# EAGLE schematic iiitduino_copy (EAGLE 7.5.0)
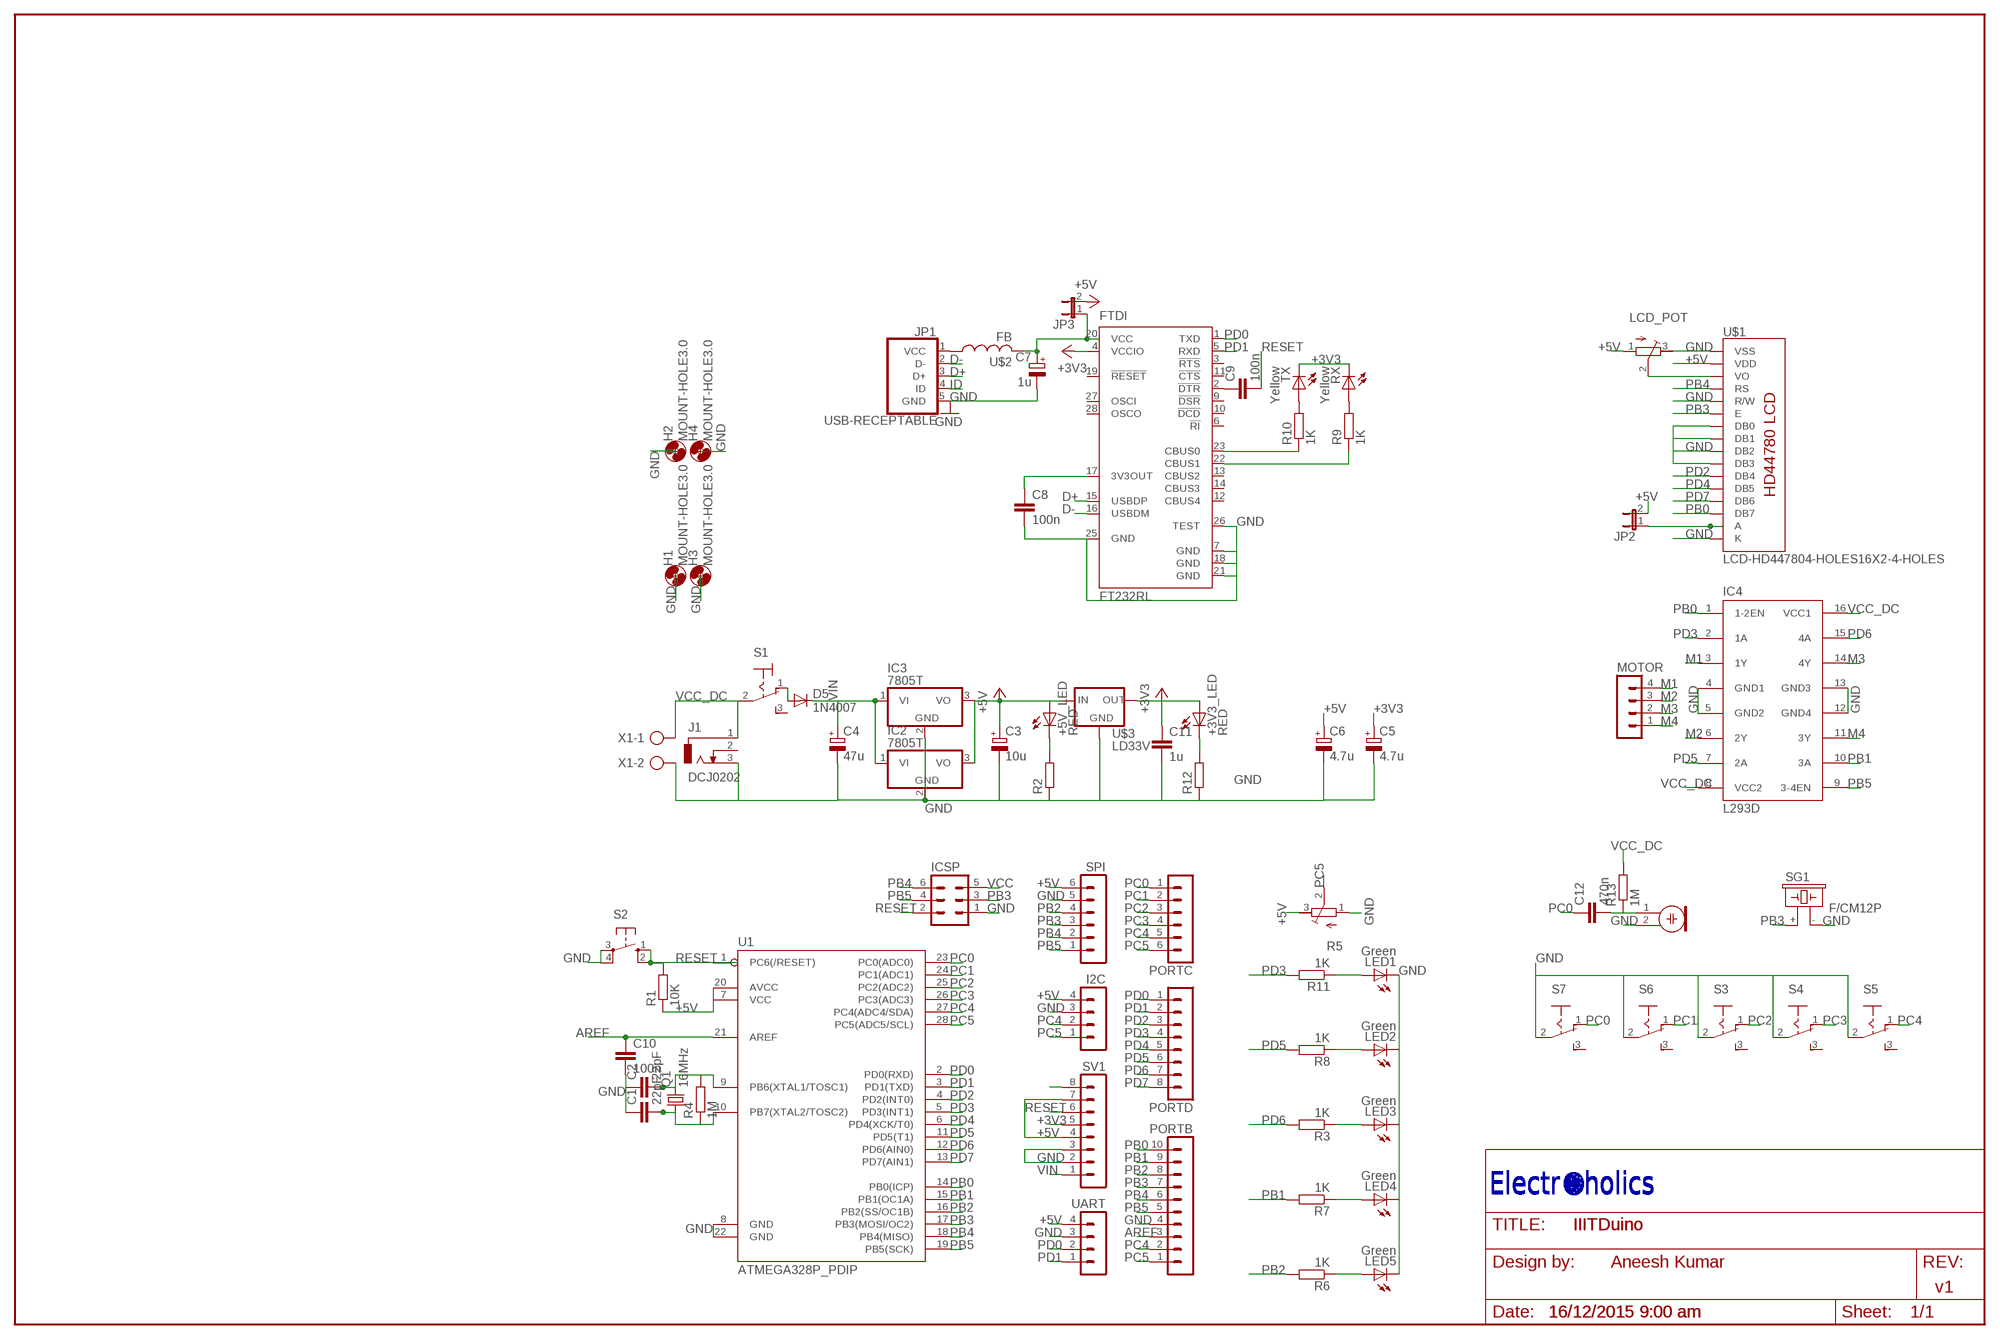
[diagram p0: schematic, sheet 1]
FRAME1 (TABL_L): DRAWING_NAME: IIITDuino; LAST_DATE_TIME: 16/12/2015 9:00 am

## Parts
+3V3_LED  RED  LED3MM  [LED3MM]
+5V_LED  RED  LED3MM  [LED3MM]
C1  22pF  C-EU025-025X050  [C025-025X050]
C2  22pF  C-EU025-025X050  [C025-025X050]
C3  10u  CPOL-EUE2.5-6  [E2,5-6]
C4  47u  CPOL-EUE5-10.5  [E5-10,5]
C5  4.7u  CPOL-EUE2.5-6  [E2,5-6]
C6  4.7u  CPOL-EUE2.5-6  [E2,5-6]
C7  1u  CPOL-EUE2.5-6  [E2,5-6]
C8  100n  C-EU025-025X050  [C025-025X050]
C9  100n  C-EU025-025X050  [C025-025X050]
C10  100n  C-EU025-025X050  [C025-025X050]
C11  1u  C-EU025-025X050  [C025-025X050]
C12  470n  C-EU025-025X050  [C025-025X050]
D5  1N4007  1N4004  [DO41-10]
FTDI  FT232RL  [SSOP28]
H1  MOUNT-HOLE3.0  [3,0]
H2  MOUNT-HOLE3.0  [3,0]
H3  MOUNT-HOLE3.0  [3,0]
H4  MOUNT-HOLE3.0  [3,0]
I2C  MA04-1  [MA04-1]
IC2  7805T  [TO220H]
IC3  7805T  [TO220H]
IC4  L293D  [DIL16]
ICSP  MA03-2  [MA03-2]
J1  DCJ0202  [DCJ0202]
JP1  USB-RECEPTABLE  [FCI-10103594-0001LF]
JP2  JP1E  [JP1]
JP3  JP1E  [JP1]
LCD_POT  R-TRIMM64W  [RTRIM64W]
LED1  Green  LED3MM  [LED3MM]
LED2  Green  LED3MM  [LED3MM]
LED3  Green  LED3MM  [LED3MM]
LED4  Green  LED3MM  [LED3MM]
LED5  Green  LED3MM  [LED3MM]
M1  ELECTRET_MICROPHON-F6050AP  [F6050AP]
MOTOR  MA04-1  [MA04-1]
PORTB  MA10-1W  [MA10-1W]
PORTC  MA06-1  [MA06-1]
PORTD  MA08-1  [MA08-1]
Q1  16MHz  CRYSTALHC49U70  [HC49U70]
R1  10K  R-EU_0207/10  [0207/10]
R2  R-EU_0207/7  [0207/7]
R3  1K  R-EU_0207/10  [0207/10]
R4  1M  R-EU_0207/10  [0207/10]
R5  R-TRIMM64W  [RTRIM64W]
R6  1K  R-EU_0207/10  [0207/10]
R7  1K  R-EU_0207/10  [0207/10]
R8  1K  R-EU_0207/10  [0207/10]
R9  1K  R-EU_0207/7  [0207/7]
R10  1K  R-EU_0207/7  [0207/7]
R11  1K  R-EU_0207/10  [0207/10]
R12  R-EU_0207/7  [0207/7]
R13  1M  R-EU_0207/10  [0207/10]
RX  Yellow  LED3MM  [LED3MM]
S1  320-916  [320-916]
S2  10-XX  [B3F-10XX]
S3  255SB  [255SB]
S4  255SB  [255SB]
S5  255SB  [255SB]
S6  255SB  [255SB]
S7  255SB  [255SB]
SG1  F/CM12P  [F/CM12P]
SPI  MA06-1  [MA06-1]
SV1  MA08-1  [MA08-1]
TX  Yellow  LED3MM  [LED3MM]
U1  ATMEGA328P_PDIP  [DIL28-3]
U$1  LCD-HD447804-HOLES16X2-4-HOLES  [LCD-16X2-4HOLES]
U$2  FB  [FB]
U$3  LD33V  [TO-220]
UART  MA04-1  [MA04-1]
X1  AK300/2  [AK300/2]

## Nets
+3V3: +3V3_LED.A C5.+ C11.1 FTDI.4(VCCIO) RX.K(C) SV1.5 TX.K(C) U$3.2(OUT)
+5V: +5V_LED.A C3.+ C6.+ C7.+ FTDI.20(VCC) I2C.4 IC2.3(VO) IC3.3(VO) JP2.2 JP3.1 JP3.2 LCD_POT.1(A) R1.1 R5.3(E) SPI.6 SV1.4 SV1.7 U1.7(VCC) U1.20(AVCC) U$1.2(VDD) U$2.P$2 U$3.3(IN) UART.4
AREF: C10.1 PORTB.3 U1.21(AREF)
D+: FTDI.15(USBDP) JP1.3(D+)
D-: FTDI.16(USBDM) JP1.2(D-)
GND: C1.1 C2.1 C3.- C4.- C5.- C6.- C7.- C8.2 C10.2 C11.2 FTDI.7(GND) FTDI.18(GND) FTDI.21(GND) FTDI.25(GND) FTDI.26(TEST) I2C.3 IC2.2(GND) IC3.2(GND) IC4.4(GND1) IC4.5(GND2) IC4.12(GND4) IC4.13(GND3) ICSP.1 J1.3 JP1.5(GND) LCD_POT.3(E) LED1.K(C) LED2.K(C) LED3.K(C) LED4.K(C) LED5.K(C) M1.2 PORTB.4 R2.1 R5.1(A) R12.1 S2.3(P) S2.4(P1) S3.2(P) S4.2(P) S5.2(P) S6.2(P) S7.2(P) SG1.- SPI.5 SV1.2 SV1.3 U1.8(GND) U1.22(GND) U$1.1(VSS) U$1.5(R/W) U$1.7(DB0) U$1.8(DB1) U$1.9(DB2) U$1.10(DB3) U$1.16(K) U$3.1(GND) UART.3 X1.2
ID: JP1.4(ID)
M1: IC4.3(1Y) MOTOR.4
M2: IC4.6(2Y) MOTOR.3
M3: IC4.14(4Y) MOTOR.2
M4: IC4.11(3Y) MOTOR.1
N$1: JP1.1(VCC) U$2.P$1
N$2: C1.2 Q1.1 R4.1 U1.10(PB7(XTAL2/TOSC2))
N$3: D5.A S1.1(O)
N$4: +3V3_LED.K(C) R12.2
N$5: C12.2 M1.1 R13.1
N$7: C8.1 FTDI.17(3V3OUT)
N$8: +5V_LED.K(C) R2.2
N$9: JP2.1 U$1.15(A)
N$10: LED3.A R3.1
N$11: R10.2 TX.A
N$12: C2.2 Q1.2 R4.2 U1.9(PB6(XTAL1/TOSC1))
N$13: R9.2 RX.A
N$14: FTDI.23(CBUS0) R10.1
N$15: FTDI.22(CBUS1) R9.1
N$16: C9.1 FTDI.2(!DTR)
N$18: LED5.A R6.1
N$20: LED4.A R7.1
N$22: LED2.A R8.1
N$24: LED1.A R11.1
N$25: SV1.8
PB0: IC4.1(1-2EN) PORTB.10 U1.14(PB0(ICP)) U$1.14(DB7)
PB1: IC4.10(3A) PORTB.9 R7.2 U1.15(PB1(OC1A))
PB2: PORTB.8 R6.2 SPI.4 U1.16(PB2(SS/OC1B))
PB3: ICSP.3 PORTB.7 SG1.+ SPI.3 U1.17(PB3(MOSI/OC2)) U$1.6(E)
PB4: ICSP.6 PORTB.6 SPI.2 U1.18(PB4(MISO)) U$1.4(RS)
PB5: IC4.9(3-4EN) ICSP.4 PORTB.5 SPI.1 U1.19(PB5(SCK))
PC0: C12.1 PORTC.1 S7.1(O) U1.23(PC0(ADC0))
PC1: PORTC.2 S6.1(O) U1.24(PC1(ADC1))
PC2: PORTC.3 S3.1(O) U1.25(PC2(ADC2))
PC3: PORTC.4 S4.1(O) U1.26(PC3(ADC3))
PC4: I2C.2 PORTB.2 PORTC.5 S5.1(O) U1.27(PC4(ADC4/SDA))
PC5: I2C.1 PORTB.1 PORTC.6 R5.2(S) U1.28(PC5(ADC5/SCL))
PC6: U1.1(PC6(/RESET))
PD0: FTDI.1(TXD) PORTD.1 U1.2(PD0(RXD)) UART.2
PD1: FTDI.5(RXD) PORTD.2 U1.3(PD1(TXD)) UART.1
PD2: PORTD.3 U1.4(PD2(INT0)) U$1.11(DB4)
PD3: IC4.2(1A) PORTD.4 R11.2 U1.5(PD3(INT1))
PD4: PORTD.5 U1.6(PD4(XCK/T0)) U$1.12(DB5)
PD5: IC4.7(2A) PORTD.6 R8.2 U1.11(PD5(T1))
PD6: IC4.15(4A) PORTD.7 R3.2 U1.12(PD6(AIN0))
PD7: PORTD.8 U1.13(PD7(AIN1)) U$1.13(DB6)
RESET: C9.2 ICSP.2 R1.2 S2.1(S) S2.2(S1) SV1.6
VCC: ICSP.5
VCC_DC: IC4.8(VCC2) IC4.16(VCC1) J1.1 R13.2 S1.2(P) X1.1
VIN: C4.+ D5.C IC2.1(VI) IC3.1(VI) SV1.1
VO: LCD_POT.2(S) U$1.3(VO)
Unconnected: FTDI.3(!RTS) FTDI.6(!RI) FTDI.9(!DSR) FTDI.10(!DCD) FTDI.11(!CTS) FTDI.12(CBUS4) FTDI.13(CBUS2) FTDI.14(CBUS3) FTDI.19(!RESET) FTDI.27(OSCI) FTDI.28(OSCO) J1.2 S1.3(S) S3.3(S) S4.3(S) S5.3(S) S6.3(S) S7.3(S)

## Library data of the parts
+3V3_LED +5V_LED LED1-LED5 RX TX = led:LED: LED OSRAM: - CHIPLED LG R971, LG N971, LY N971, LG Q971, LY Q971, LO R971, LY R971 LH N974, LH R974 LS Q976, LO Q976, LY Q976 LO Q996 - Hyper CHIPLED LW Q18S LB Q993, LB Q99A, LB R99A - SideLED LS A670, LO A670, LY A670, LG A670, LP A670 LB A673, LV A673, LT A673, LW A673 LH A674 LY A675 LS A676, LA A676, LO A676, LY A676, LW A676 LS A679, LY A679, LG A679 - Hyper Micro SIDELED® LS Y876, LA Y876, LO Y876, LY Y876 LT Y87S - SmartLED LW L88C, LW L88S LB L89C, LB L89S, LG L890 LS L89K, LO L89K, LY L89K LS L896, LA L896, LO L896, LY L896 - TOPLED LS T670, LO T670, LY T670, LG T670, LP T670 LSG T670, LSP T670, LSY T670, LOP T670, LYG T670 LG T671, LOG T671, LSG T671 LB T673, LV T673, LT T673, LW T673 LH T674 LS T676, LA T676, LO T676, LY T676, LB T676, LH T676, LSB T676, LW T676 LB T67C, LV T67C, LT T67C, LS T67K, LO T67K, LY T67K, LW E67C LS E67B, LA E67B, LO E67B, LY E67B, LB E67C, LV E67C, LT E67C LW T67C LS T679, LY T679, LG T679 LS T770, LO T770, LY T770, LG T770, LP T770 LB T773, LV T773, LT T773, LW T773 LH T774 LS E675, LA E675, LY E675, LS T675 LS T776, LA T776, LO T776, LY T776, LB T776 LHGB T686 LT T68C, LB T68C - Hyper Mini TOPLED® LB M676 - Mini TOPLED Santana® LG M470 LS M47K, LO M47K, LY M47K Source: http://www.osram.convergy.de LUXEON: - LUMILED® LXK2-PW12-R00, LXK2-PW12-S00, LXK2-PW14-U00, LXK2-PW14-V00 LXK2-PM12-R00, LXK2-PM12-S00, LXK2-PM14-U00 LXK2-PE12-Q00, LXK2-PE12-R00, LXK2-PE12-S00, LXK2-PE14-T00, LXK2-PE14-U00 LXK2-PB12-K00, LXK2-PB12-L00, LXK2-PB12-M00, LXK2-PB14-N00, LXK2-PB14-P00, LXK2-PB14-Q00 LXK2-PR12-L00, LXK2-PR12-M00, LXK2-PR14-Q00, LXK2-PR14-R00 LXK2-PD12-Q00, LXK2-PD12-R00, LXK2-PD12-S00 LXK2-PH12-R00, LXK2-PH12-S00 LXK2-PL12-P00, LXK2-PL12-Q00, LXK2-PL12-R00 Source: www.luxeon.com KINGBRIGHT: KA-3528ASYC Source: www.kingbright.com
C1 C2 C8-C12 = rcl:C-EU: CAPACITOR, European symbol
C3-C7 = rcl:CPOL-EU: POLARIZED CAPACITOR, European symbol
D5 = diode:1N4004: DIODE general purpose rectifier, 1 A
FTDI = ftdichip:FT232R: Source: http://www.ftdichip.com/Documents/DataSheets/DS_FT232R_v104.pdf; MPN: FT232RL; OC_FARNELL: 1146032; OC_NEWARK: 91K9918
H1-H4 = holes:MOUNT-HOLE: MOUNTING HOLE with drill center marker
I2C MOTOR UART = con-lstb:MA04-1: PIN HEADER; OC_FARNELL: unknown; OC_NEWARK: unknown
IC2 IC3 = linear:78*: Positive VOLTAGE REGULATOR Source: http://cache.national.com/ds/LM/LM78L05.pdf http://www.fairchildsemi.com/ds/LM/LM7805.pdf
IC4 = st-microelectronics:L293D: PUSH-PULL 4 CHANNEL DRIVER; MPN: L293D; OC_FARNELL: 9589619; OC_NEWARK: 56P8249
ICSP = con-lstb:MA03-2: PIN HEADER; OC_FARNELL: unknown; OC_NEWARK: unknown
J1 = con-jack:DCJ0202: DC POWER JACK Source: DCJ0202.pdf; OC_FARNELL: unknown; OC_NEWARK: unknown
JP1 = daspilker:USB-RECEPTABLE: USB Receptable
JP2 JP3 = jumper:JP1E: JUMPER
LCD_POT R5 = rcl:R-TRIMM: Trimm resistor
M1 = microphon:ELECTRET_MICROPHON-: Electret Condenser Microphone
PORTB = con-lstb:MA10-1W: PIN HEADER; OC_FARNELL: unknown; OC_NEWARK: unknown
PORTC SPI = con-lstb:MA06-1: PIN HEADER; OC_FARNELL: unknown; OC_NEWARK: unknown
PORTD SV1 = con-lstb:MA08-1: PIN HEADER; OC_FARNELL: unknown; OC_NEWARK: unknown
Q1 = crystal:CRYSTAL: CRYSTAL; OC_FARNELL: unknown; OC_NEWARK: unknown
R1-R4 R6-R13 = rcl:R-EU_: RESISTOR, European symbol
S1 = switch:320-916: TOGGLE SWITCH distributor RS Components
S2 = switch-omron:10-XX: OMRON SWITCH; MPN: B3F-1000; OC_FARNELL: 176432; OC_NEWARK: 36M3542
S3-S7 = switch:255SB: SLIDING SWITCH Distributor Buerklin, 11G810
SG1 = buzzer:F/CM12P: BUZZER Source: Buerklin; OC_FARNELL: unknown; OC_NEWARK: unknown
U1 = SparkFun-DigitalIC:ATMEGA328P_PDIP: uC used in the Arduino 32kb flash, 1k EEPROM, 2k SRAM This is the through-hole version of this chip.
U$1 = HD44780LCD:LCD-HD44780
U$2 = adafruit:FB: Ferrite bead Digikey #P9821BK-ND
U$3 = ldv33:LD33V: LD33V - (LD1117#33) : 3.3V Low dropout positive voltage regulator
X1 = con-ptr500:AK300/2: CONNECTOR; OC_FARNELL: unknown; OC_NEWARK: unknown